# Altium schematic sheet NTC Sense.SchDoc
size A4; SheetNumber: 6; SheetTotal: 6
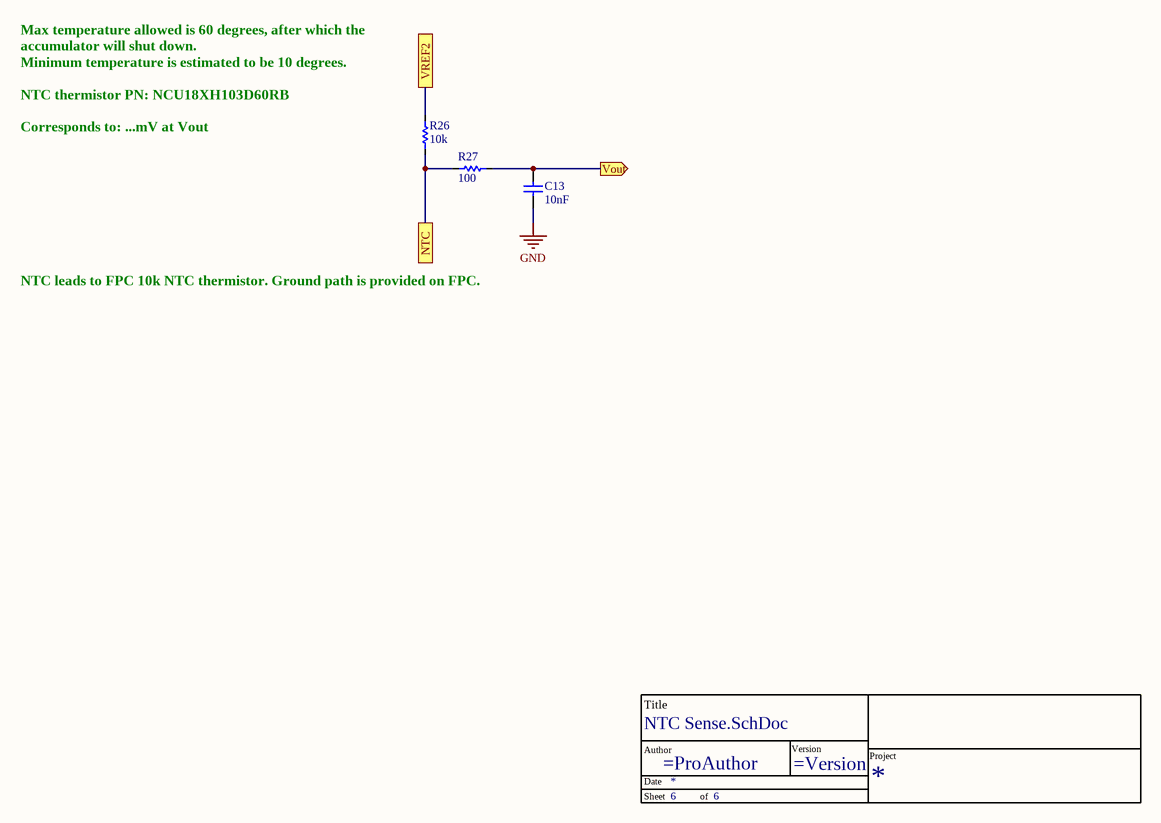
[diagram p0: NTC Sense.SchDoc]

## Parts
*  TitleBlock  (value not drawn)  (graphical)
C13  value 10nF  [C_0603]  (hidden comment: C)
R26  value 10k  [R-0603]  (hidden comment: Resistor)
R27  value 100  [R-0603]  (hidden comment: Resistor)

## Ports
NTC, Vout (out), VREF2

## Nets
GND: C13.1
NTC: R26.1 R27.2 ; port NTC
Vout: C13.2 R27.1 ; port Vout
VREF2: R26.2 ; port VREF2

## Notes on the sheet
- Max temperature allowed is 60 degrees, after which the accumulator will shut down.
  Minimum temperature is estimated to be 10 degrees.
  NTC thermistor PN: NCU18XH103D60RB
  Corresponds to: ...mV at Vout
- NTC leads to FPC 10k NTC thermistor. Ground path is provided on FPC.
- (in symbol TitleBlock) Title; Author; Version; Project; Date; Sheet; of

## Library data of the parts
C13 = Capacitor: ComponentLink1Description: New link; ComponentLink1URL: *